# EAGLE schematic DEPDisc horizontal electrodes 100µm v1 (EAGLE 9.7.0)
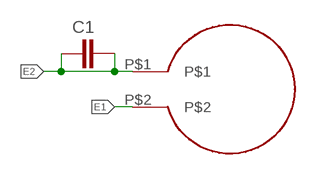
[diagram p0: schematic, sheet 1]

## Parts
C1  C-EUC0805K  [C0805K]
U$3  COIL_22_10_1.8  [COIL_22_10_1.8]

## Nets
E1: U$3.P$2
E2: C1.1 C1.2 U$3.P$1

## Library data of the parts
C1 = resistor:C-EU: CAPACITOR, European symbol
U$3 = Trace_Coils:COIL_22_10_1.8